# Altium schematic sheet Backplane_Breakout_Adapter_Notes.SchDoc: Design Notes
size B; Date: 10/01/2021; Author: Sample Author; Organization: ORGANIZATION; Address1: ADDRESS 1; Address2: ADDRESS 2; Address3: ADDRESS 3; Address4: ADDRESS 4; Revision: -; SheetNumber: 2; SheetTotal: 2; ENG_APP_DATE: --/--/--; DSN_APP_DATE: --/--/--; CHK_APP_DATE: --/--/--
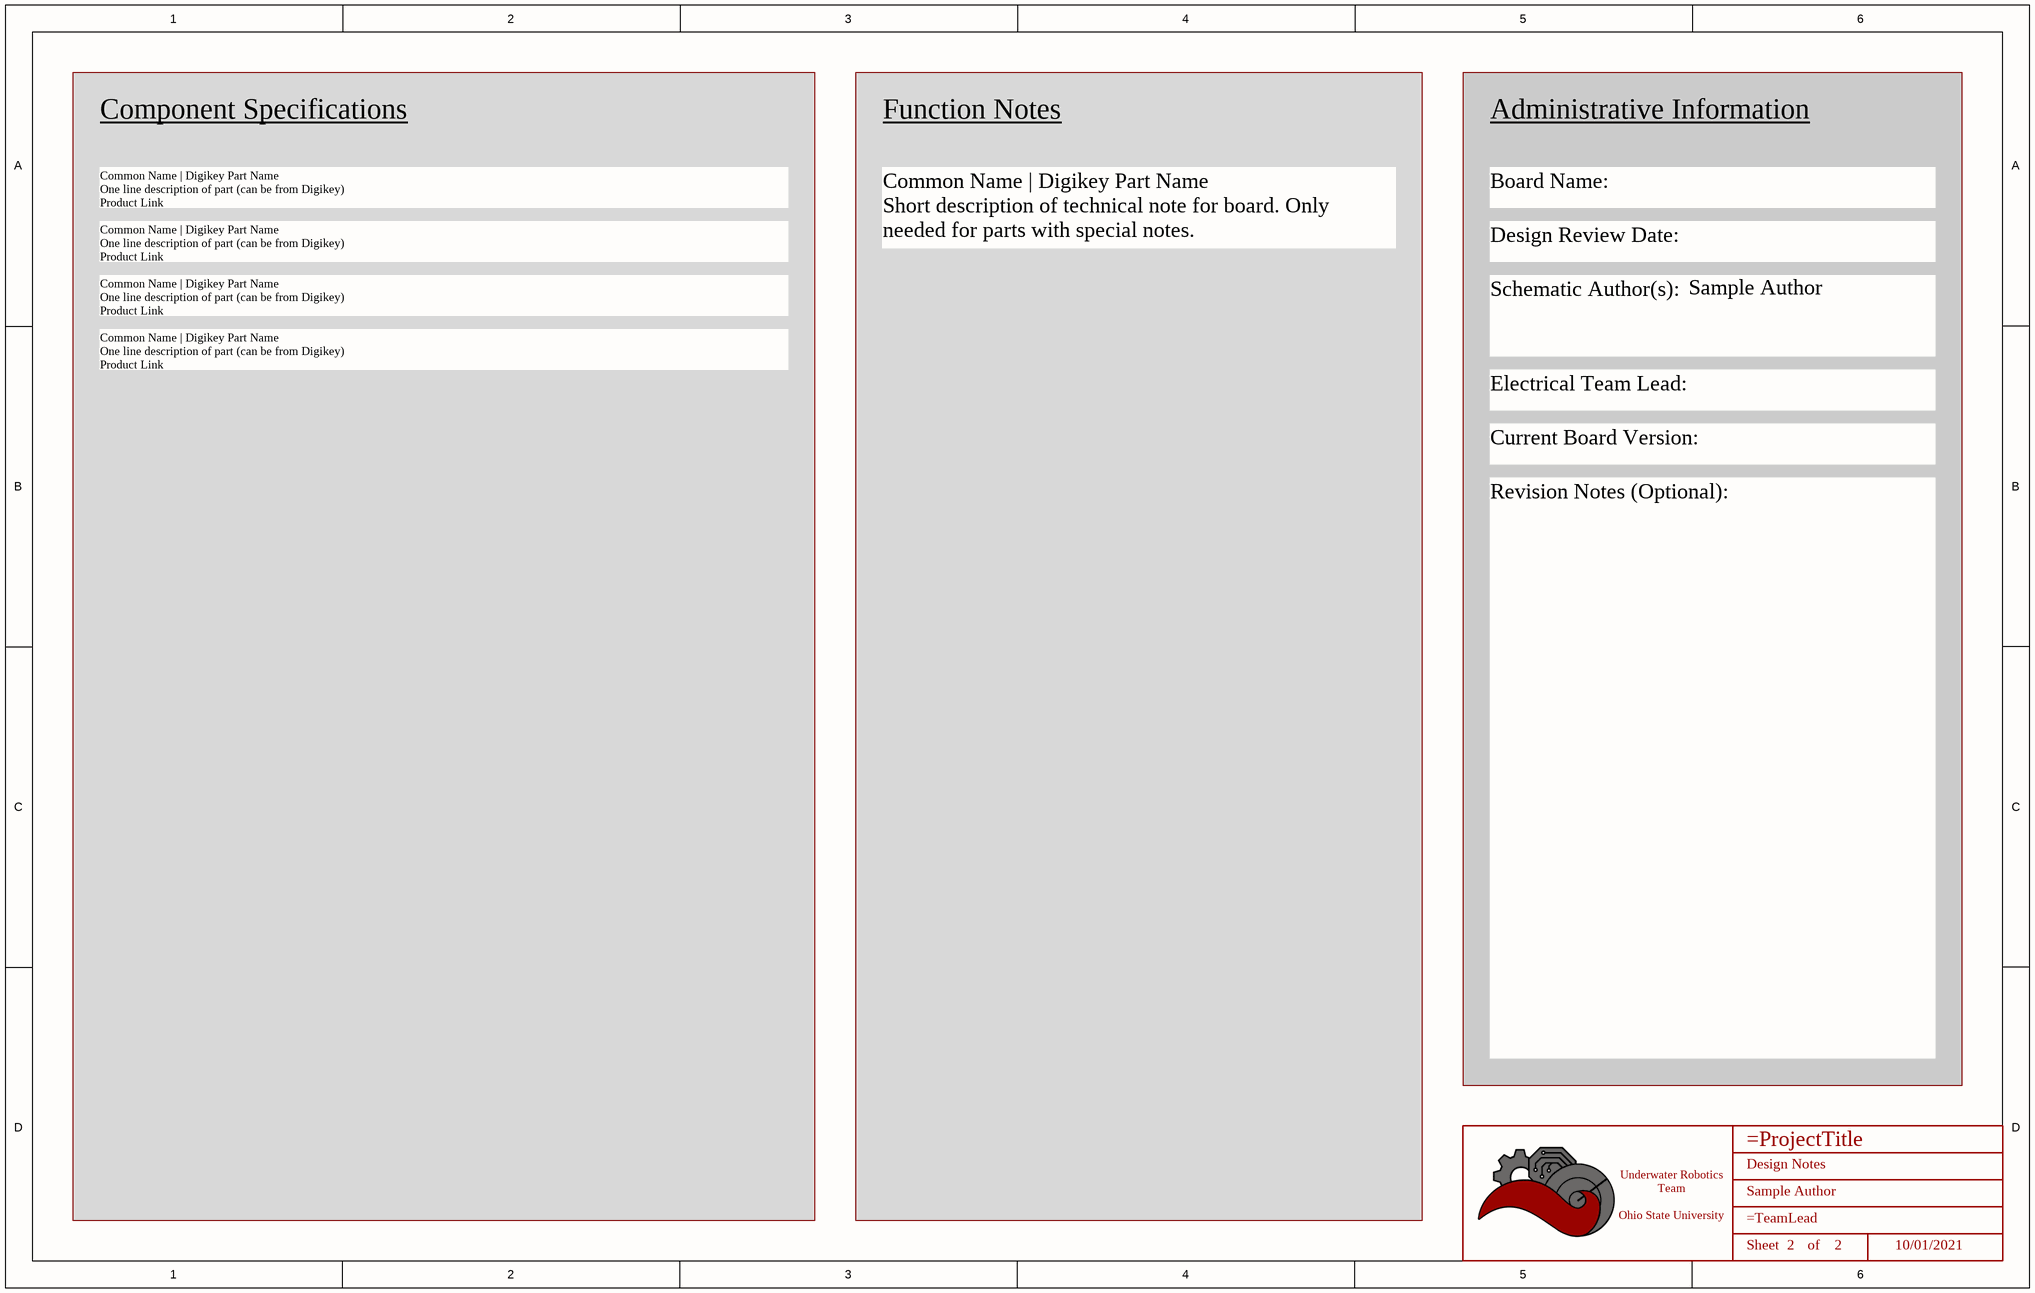
[diagram p0: Backplane_Breakout_Adapter_Notes.SchDoc]

## Parts
*  Title_Block  [LOGO]  (value not drawn)  (graphical)

## Notes on the sheet
- Component Specifications
- Function Notes
- Administrative Information
- Common Name | Digikey Part Name
  One line description of part (can be from Digikey)
  Product Link
- Board Name:
- Common Name | Digikey Part Name
  Short description of technical note for board. Only needed for parts with special notes.
- Design Review Date:
- Schematic Author(s):
- Electrical Team Lead:
- Current Board Version:
- Revision Notes (Optional):
- DWG. NO.
- REV.
- SHT.
- THIS DOCUMENT AND THE DATA DISCLOSED HEREIN OR HEREWITH IS THE PROPERTY OF ALTIUM LIMITED AND MAY BE FREELY DISTRIBUTED IN WHOLE. NO RIGHTS ARE RESERVED OR EXPRESS OR IMPLIED WARANTEE GIVEN.
- REVISION
- DESCRIPTION
- DATE
- APPROVED
- ENG:
- APPROVALS
- PROJECT
- DSN:
- CHK:
- REFERENCE DOCUMENTS
- PROJECT REVISION:
- TITLE
- DOCUMENT REVISION:
- DESIGN ITEM:
- BOM:
- FAB DWG:
- PCB DWG:
- ASSY DWG:
- SCALE:
- SIZE
- B
- CAGE CODE
- FILE NAME
- DWG NO.
- SHEET
- OF
- REV
- (in symbol Title_Block) Underwater Robotics Team / Ohio State University; Sheet; of

## Library data of the parts
* = Title_Block: UWRT Schematic Title Block Template / Created June 2021, Dylan Trainor